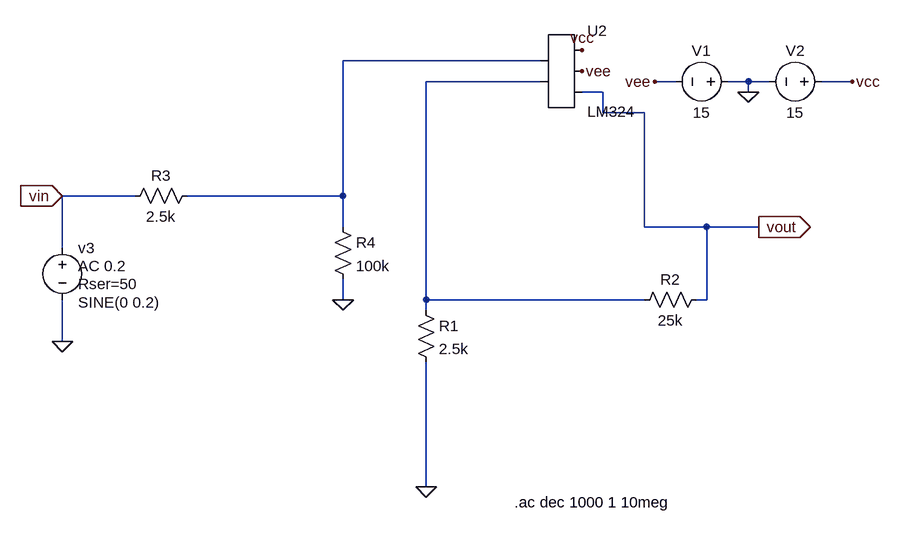
[diagram p0: schematic ej1_circ2_caso2.asc]
ej1_circ2_caso2.asc, the LTspice schematic file:
Version 4
SHEET 1 880 680
WIRE 208 -176 -96 -176
WIRE 208 -144 32 -144
WIRE 416 -144 384 -144
WIRE 528 -144 496 -144
WIRE 560 -144 528 -144
WIRE 688 -144 640 -144
WIRE 304 -128 272 -128
WIRE 528 -128 528 -144
WIRE 304 -96 304 -128
WIRE 368 -96 304 -96
WIRE -416 32 -528 32
WIRE -96 32 -96 -176
WIRE -96 32 -336 32
WIRE -96 80 -96 32
WIRE 368 80 368 -96
WIRE 464 80 368 80
WIRE 544 80 464 80
WIRE -528 112 -528 32
WIRE -96 192 -96 160
WIRE 32 192 32 -144
WIRE 368 192 32 192
WIRE 464 192 464 80
WIRE 464 192 448 192
WIRE 32 208 32 192
WIRE -528 256 -528 192
WIRE 32 480 32 288
FLAG 544 80 vout
IOPIN 544 80 Out
FLAG 528 -128 0
FLAG 384 -144 vee
FLAG 688 -144 vcc
FLAG -528 32 vin
IOPIN -528 32 In
FLAG -528 256 0
FLAG 32 480 0
FLAG -96 192 0
FLAG 272 -192 vcc
FLAG 272 -160 vee
SYMBOL res 464 176 R90
WINDOW 0 0 56 VBottom 2
WINDOW 3 32 56 VTop 2
SYMATTR InstName R2
SYMATTR Value 25k
SYMBOL res -112 64 R0
SYMATTR InstName R4
SYMATTR Value 100k
SYMBOL voltage 512 -144 R90
WINDOW 0 -32 56 VBottom 2
WINDOW 3 32 56 VTop 2
WINDOW 123 0 0 Left 2
WINDOW 39 0 0 Left 2
SYMATTR InstName V1
SYMATTR Value 15
SYMBOL voltage 656 -144 R90
WINDOW 0 -32 56 VBottom 2
WINDOW 3 32 56 VTop 2
WINDOW 123 0 0 Left 2
WINDOW 39 0 0 Left 2
SYMATTR InstName V2
SYMATTR Value 15
SYMBOL voltage -528 96 R0
WINDOW 123 24 44 Left 2
WINDOW 39 24 72 Left 2
WINDOW 3 24 100 Left 2
SYMATTR Value2 AC 0.2
SYMATTR SpiceLine Rser=50
SYMATTR Value SINE(0 0.2)
SYMATTR InstName v3
SYMBOL res -432 48 R270
WINDOW 0 32 56 VTop 2
WINDOW 3 0 56 VBottom 2
SYMATTR InstName R3
SYMATTR Value 2.5k
SYMBOL res 16 192 R0
SYMATTR InstName R1
SYMATTR Value 2.5k
SYMBOL AutoGenerated\\LM324 240 -160 R0
SYMATTR InstName U2
TEXT 168 504 Left 2 !.ac dec 1000 1 10meg

The netlist it stands for:
* ej1_circ2_caso2.asc
R2 vout N002 25k
R4 N001 0 100k
V1 0 vee 15
V2 vcc 0 15
v3 vin 0 SINE(0 0.2) AC 0.2 Rser=50
R3 vin N001 2.5k
R1 N002 0 2.5k
* U2: LM324 (symbol AutoGenerated\LM324 not available, pins judged from their places): pin1=N001 pin2=N002 pin3=vcc pin4=vee pin5=vout
.ac dec 1000 1 10meg
.backanno
.end